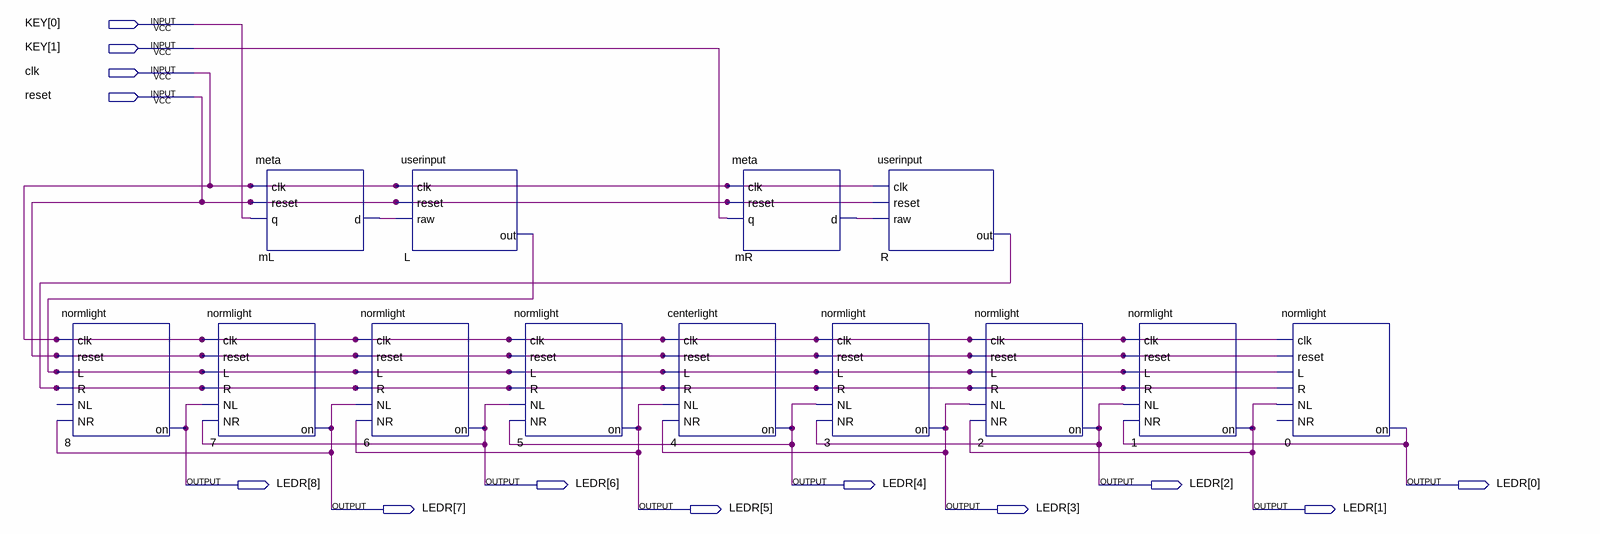
[diagram p0: schematic sheet]
// Quartus schematic block diagram.bdf as structural Verilog: 13 symbols, 13 pins
module \block_diagram  (
  input  [1:0] KEY,
  input  clk,
  input  reset,
  output [8:0] LEDR
);

  wire L_out, mL_d, mR_d, R_out;

  normlight u_8 (.clk(clk), .reset(reset), .L(L_out), .R(R_out), .NR(LEDR[7]), .on(LEDR[8]));  // open: NL
  normlight u_7 (.clk(clk), .reset(reset), .L(L_out), .R(R_out), .NL(LEDR[8]), .NR(LEDR[6]), .on(LEDR[7]));
  meta mL (.clk(clk), .reset(reset), .q(KEY[0]), .d(mL_d));
  normlight u_6 (.clk(clk), .reset(reset), .L(L_out), .R(R_out), .NL(LEDR[7]), .NR(LEDR[5]), .on(LEDR[6]));
  userinput L (.clk(clk), .reset(reset), .raw(mL_d), .out(L_out));
  normlight u_5 (.clk(clk), .reset(reset), .L(L_out), .R(R_out), .NL(LEDR[6]), .NR(LEDR[4]), .on(LEDR[5]));
  centerlight u_4 (.clk(clk), .reset(reset), .L(L_out), .R(R_out), .NL(LEDR[5]), .NR(LEDR[3]), .on(LEDR[4]));
  meta mR (.clk(clk), .reset(reset), .q(KEY[1]), .d(mR_d));
  normlight u_3 (.clk(clk), .reset(reset), .L(L_out), .R(R_out), .NL(LEDR[4]), .NR(LEDR[2]), .on(LEDR[3]));
  userinput R (.clk(clk), .reset(reset), .raw(mR_d), .out(R_out));
  normlight u_2 (.clk(clk), .reset(reset), .L(L_out), .R(R_out), .NL(LEDR[3]), .NR(LEDR[1]), .on(LEDR[2]));
  normlight u_1 (.clk(clk), .reset(reset), .L(L_out), .R(R_out), .NL(LEDR[2]), .NR(LEDR[0]), .on(LEDR[1]));
  normlight u_0 (.clk(clk), .reset(reset), .L(L_out), .R(R_out), .NL(LEDR[1]), .on(LEDR[0]));  // open: NR
endmodule
